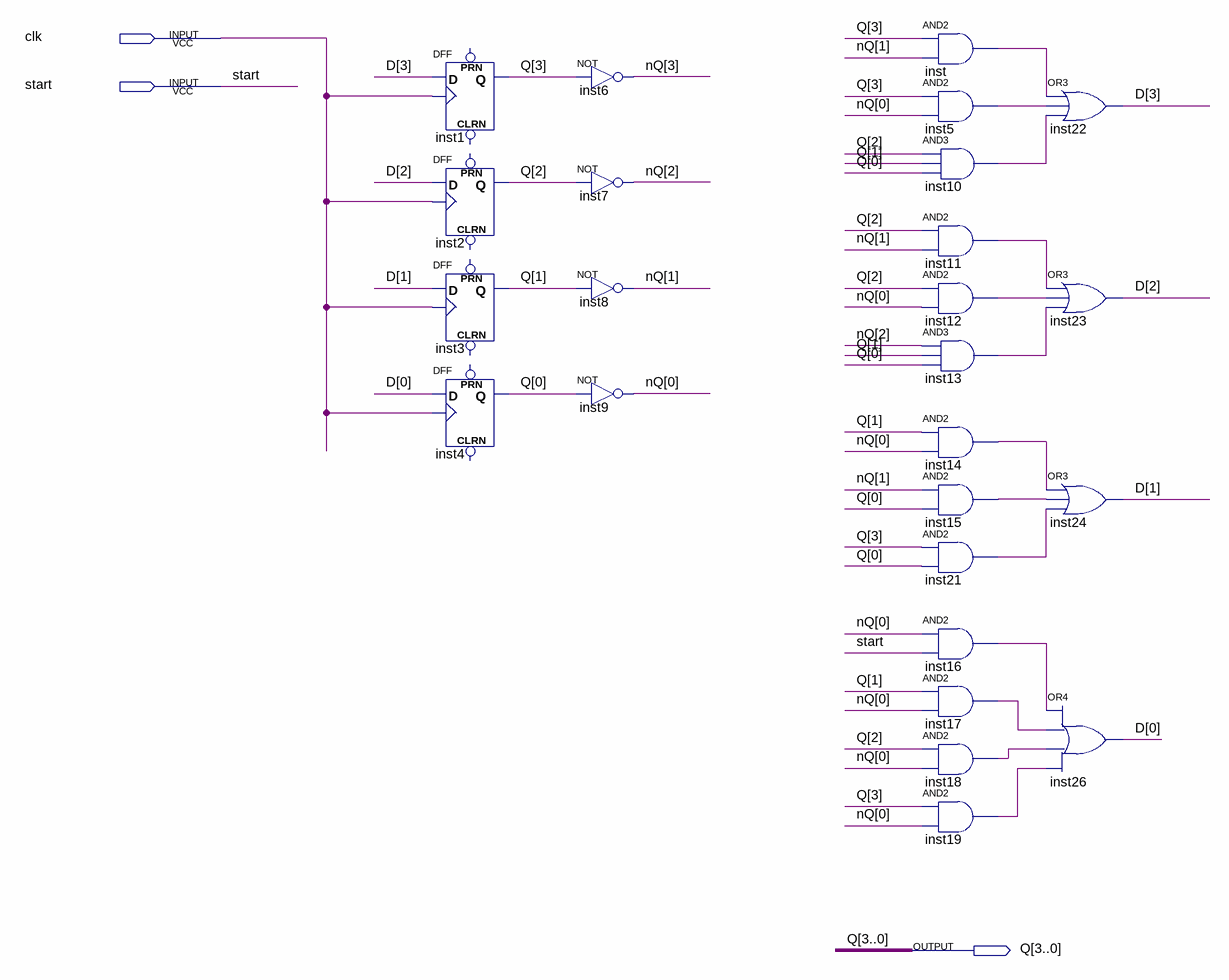
[diagram p0: schematic sheet]
// Quartus schematic FSM.bdf as structural Verilog: 25 symbols, 3 pins
module FSM (
  input  clk,
  input  start,
  output [3:0] Q
);

  wire inst5_out, inst10_out, inst11_out, inst12_out, inst13_out, inst14_out, inst15_out, inst16_out,
       inst17_out, inst18_out, inst19_out, inst21_out, inst_out;
  wire [3:0] D, nQ;

  DFF inst1 (.CLK(clk), .D(D[3]), .Q(Q[3]));  // open: CLRN, PRN
  DFF inst2 (.CLK(clk), .D(D[2]), .Q(Q[2]));  // open: CLRN, PRN
  DFF inst3 (.CLK(clk), .D(D[1]), .Q(Q[1]));  // open: CLRN, PRN
  DFF inst4 (.CLK(clk), .D(D[0]), .Q(Q[0]));  // open: CLRN, PRN
  not inst6 (nQ[3], Q[3]);
  not inst7 (nQ[2], Q[2]);
  not inst8 (nQ[1], Q[1]);
  not inst9 (nQ[0], Q[0]);
  and inst (inst_out, Q[3], nQ[1]);
  and inst5 (inst5_out, Q[3], nQ[0]);
  and inst10 (inst10_out, Q[2], Q[1], Q[0]);
  and inst11 (inst11_out, Q[2], nQ[1]);
  and inst12 (inst12_out, Q[2], nQ[0]);
  and inst13 (inst13_out, nQ[2], Q[1], Q[0]);
  and inst14 (inst14_out, Q[1], nQ[0]);
  and inst15 (inst15_out, nQ[1], Q[0]);
  and inst21 (inst21_out, Q[3], Q[0]);
  and inst16 (inst16_out, nQ[0], start);
  and inst17 (inst17_out, Q[1], nQ[0]);
  and inst18 (inst18_out, Q[2], nQ[0]);
  and inst19 (inst19_out, Q[3], nQ[0]);
  or inst22 (D[3], inst_out, inst5_out, inst10_out);
  or inst23 (D[2], inst11_out, inst12_out, inst13_out);
  or inst24 (D[1], inst14_out, inst15_out, inst21_out);
  or inst26 (D[0], inst16_out, inst17_out, inst18_out, inst19_out);
endmodule
